# Altium schematic sheet 12V_BOOST.SchDoc
size A; SheetNumber: 14; SheetTotal: 14
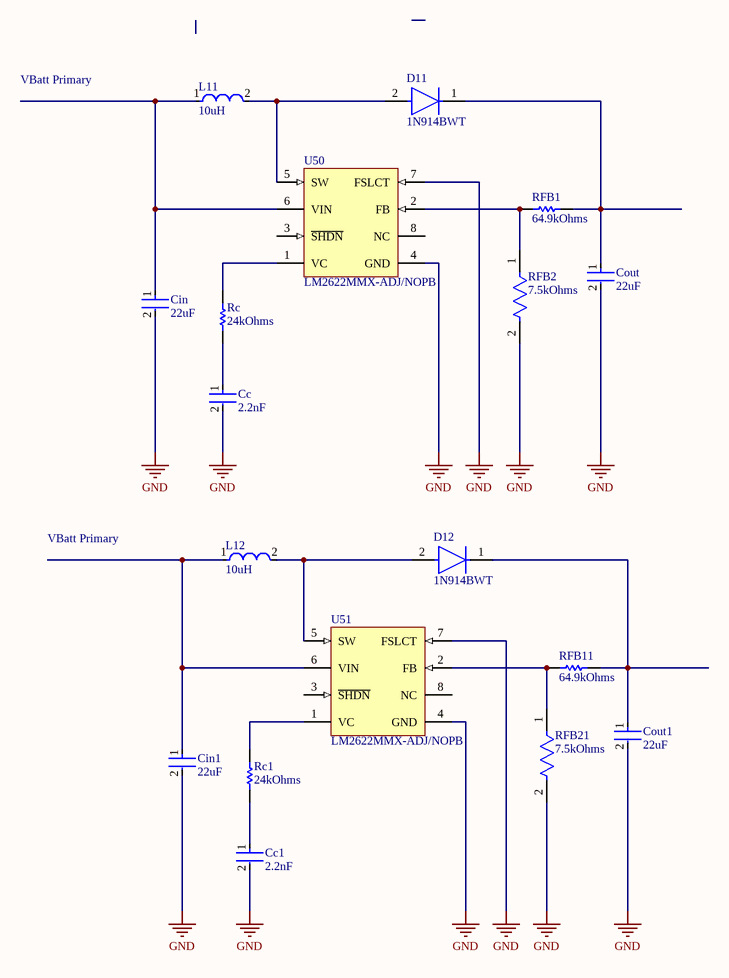
[diagram p0: 12V_BOOST.SchDoc]

## Parts
Cc  2.2nF  [FP-C0402-BB-MFG]
Cc1  2.2nF  [FP-C0402-BB-MFG]
Cin  22uF  [FP-CL31-IPC_A]
Cin1  22uF  [FP-CL31-IPC_A]
Cout  22uF  [FP-CL31-IPC_A]
Cout1  22uF  [FP-CL31-IPC_A]
D11  1N914BWT  [FP-502-01-MFG]
D12  1N914BWT  [FP-502-01-MFG]
L11  10uH  [FP-MLZ1608-IPC_C]
L12  10uH  [FP-MLZ1608-IPC_C]
Rc  24kOhms  [RESC1005X40X25ML05T05]
Rc1  24kOhms  [RESC1005X40X25ML05T05]
RFB1  64.9kOhms  [RESC3216X70X50NL05T20]
RFB2  7.5kOhms  [FP-ERJ3EK-MFG]
RFB11  64.9kOhms  [RESC3216X70X50NL05T20]
RFB21  7.5kOhms  [FP-ERJ3EK-MFG]
U50  LM2622MMX-ADJ/NOPB  [DGK0008A_M]
U51  LM2622MMX-ADJ/NOPB  [DGK0008A_M]

## Nets
GND: Cc.2 Cc1.2 Cin.2 Cin1.2 Cout.2 Cout1.2 RFB2.2 RFB21.2 U50.4(GND) U50.7(FSLCT) U51.4(GND) U51.7(FSLCT)
NetCc1_1: Cc1.1 Rc1.2
NetCc_1: Cc.1 Rc.2
NetCin1_1: Cin1.1 L12.1 U51.6(VIN)
NetCin_1: Cin.1 L11.1 U50.6(VIN)
NetCout1_1: Cout1.1 D12.1(C) RFB11.2
NetCout_1: Cout.1 D11.1(C) RFB1.2
NetD11_2: D11.2(A) L11.2 U50.5(SW)
NetD12_2: D12.2(A) L12.2 U51.5(SW)
NetRc1_1: Rc1.1 U51.1(VC)
NetRc_1: Rc.1 U50.1(VC)
NetRFB1_1: RFB1.1 RFB2.1 U50.2(FB)
NetRFB11_1: RFB11.1 RFB21.1 U51.2(FB)

Not connected (* = marked no-connect by the designer): U50 3(~{SHDN}) 8(NC); U51 3(~{SHDN}) 8(NC)

## Notes on the sheet
- VBatt Primary

## Library data of the parts
Cc Cc1 = CMP-2008-03290-2: CAP CER 2200PF 25V 5% NP0 0402; Manufacturer: Kemet; Manufacturer Part Number: C0402C222J3GACTU; Temperature Characteristic: C0G; Temperature Coefficient: 15%; Value: 2,200 pF; Tolerance: 0.05; Temperature: -55°C to +125°C; ComponentLink2URL: https://content.kemet.com/datasheets/KEM_C1002_X7R_SMD.pdf; Octopart: https://octopart.com/c0402c222j3gactu-kemet-9145102; Ipc Land Pattern Name: CAPC10050X50; RoHS: TRUE; Temperature Range High: +125°C; Device Class L3: Ceramic Capacitors; Device Class L1: Passive Components; Digikey Description: CAP CER 2200PF 25V 5% NP0 0402; Capacitance: 2,200 pF; Voltage Rating: 25 V; Automotive: No; Lead Free: Yes; ComponentLink2Description: Datasheet; Material: Ceramic; Package: C0402-BB; Temperature Range Low: -55°C; Device Class L2: Capacitors; Height: 0.55mm; Category: Cap; Mouser Description: Multilayer Ceramic Capacitors MLCC - SMD/SMT 25V 0.0022uF 5% C0G
Cin Cin1 Cout Cout1 = CMP-13271-002013-1: Cap Ceramic 22uF 16V X5R ±20% SMD 1206 +85°C Embossed T/R; Height: 0.85mm; Min Operating Temperature: -55°C; Thickness: 0.037inch; Depth: 1.6mm; Length: 3.2mm; Tolerance: 20%; Case Code (Imperial): 1206; Capacitance: 22uF; Package Quantity: 1; Radiation Hardening: No; Case/Package: 1206; Dielectric: X5R; Packaging: Tape and Reel; Voltage: 16V; Case Code (Metric): 3216; Width: 0.063inch; Lead Free: Lead Free; Mount: Surface Mount; Voltage Rating: 16V; Max Operating Temperature: 85°C
D11 D12 = CMP-07163-000008-1: DIODE GEN PURP 75V 200MA SOD523F; Manufacturer: ON Semiconductor; Forward Current: 300mA; Capacitance: 4pF; Max Junction Temp: +150°C; Reverse Voltage: 100V; Value: 4pF; Peak Reverse Current: 5uA; ComponentLink2Description: Datasheet; Package: 502-01; Manufacturer Part Number: 1N914BWT; Digikey Description: DIODE GEN PURP 75V 200MA SOD523F; Temperature Range High: +150°C; Temperature: -55°C to +150°C; Footprint Url: https://www.onsemi.com/pub/Collateral/502-01.PDF; Device Class L2: Diodes; Lead Free: Yes; Automotive: No; Category: Diode; Octopart: https://octopart.com/1n914bwt-on+semiconductor-84323166; Device Class L1: Discrete Semiconductors; Ipc Land Pattern Name: SODFL16080X60; Device Class L3: Rectifier Diodes; Height: 0.7mm; Max Repetitive Reverse Voltage: 75V; Mouser Description: Diodes - General Purpose, Power, Switching SINGLE JUNC. 100V 4.0NS COMP; Temperature Range Low: -55°C; ComponentLink2URL: https://www.onsemi.com/pub/Collateral/1N914BWT-D.pdf; RoHS: TRUE
L11 L12 = CMP-08253-000012-2: Shielded Multilayer Inductor 10uH ±20% 250mA 1365mΩ SMD 0603; Core Material: Ferrite; Resistance: 1.05R; Test Frequency: 2MHz; DC Resistance (DCR): 1.365R; Self Resonant Frequency: 50MHz; Saturation Current: 90mA; Tolerance: 20%; Current Rating: 250mA; Mount: Surface Mount; Inductance: 10uH; Package Quantity: 4000; Max Operating Temperature: 125°C; RoHS Compliant: Yes; Length: 0.063inch; Case Code (Metric): 1608; Packaging: Tape and Reel; Case/Package: 0603; Min Operating Temperature: -55°C; Case Code (Imperial): 0603; Height - Seated (Max): 0.037inch; Shielding: Shielded; Width: 0.031inch
Rc Rc1 = CMP-2002-08403-1: Part Number: CRCW040224K0FKED; Manufacturer: Vishay Dale
RFB1 RFB11 = CMP-2003-00461-1: Part Number: ERJ-8ENF64R9V; Manufacturer: Panasonic
RFB2 RFB21 = CMP-2000-00636-2: RES SMD 7.5K OHM 1% 1/10W 0603; Voltage Rating: 75V; Resistance: 7.5kR; Voltage Rating (DC): 50V; Max Power Dissipation: 100mW; Temperature Coefficient: 100ppm/°C; Military Standard: Not; Package Quantity: 1; Radiation Hardening: No; Max Operating Temperature: 155°C; Depth: 0.8mm; Mount: Surface Mount; Lead Free: Lead Free; REACH SVHC: No SVHC; Termination: SMD/SMT; Number of Terminations: 2; RoHS Compliant: Yes; Min Operating Temperature: -55°C; Case Code (Imperial): 0603; Features: Automotive AEC-Q200; Tolerance: 1%; Length: 1.6mm; Height: 0.022inch; Power Rating: 100mW; Width: 0.8mm; Resistor Type: Thick Film; Case/Package: 0603; Construction: Rectangular; Case Code (Metric): 1608; Contact Plating: Tin; Resistance Tolerance: 1%; Packaging: Tape and Reel; Series: ERJ
U50 U51 = CMP-0069-01733-3: 600kHz/1.3MHz Step-up PWM DC/DC Converter, 8-pin MSOP, Pb-Free; Manufacturer: Texas Instruments; PowerWise: N; CompType: Switcher; PackageTopMarking: ZXTT*S18B; PackageReference: DGK0008A; RoHS: Y; Code_JEDEC: MO-187-AA; ComponentLink1URL: http://www.ti.com/general/docs/lit/getliterature.tsp?genericPartNumber=LM2622&fileType=pdf; PackageDescription: MINI SOIC, .118 x .118 x .034in, 8 Lead, .0256in Pitch; ComponentLink1Description: Datasheet URL; PinCount: 8